# EAGLE board Arduino_kuukulgur-alternatiivne2 (EAGLE 6.3)
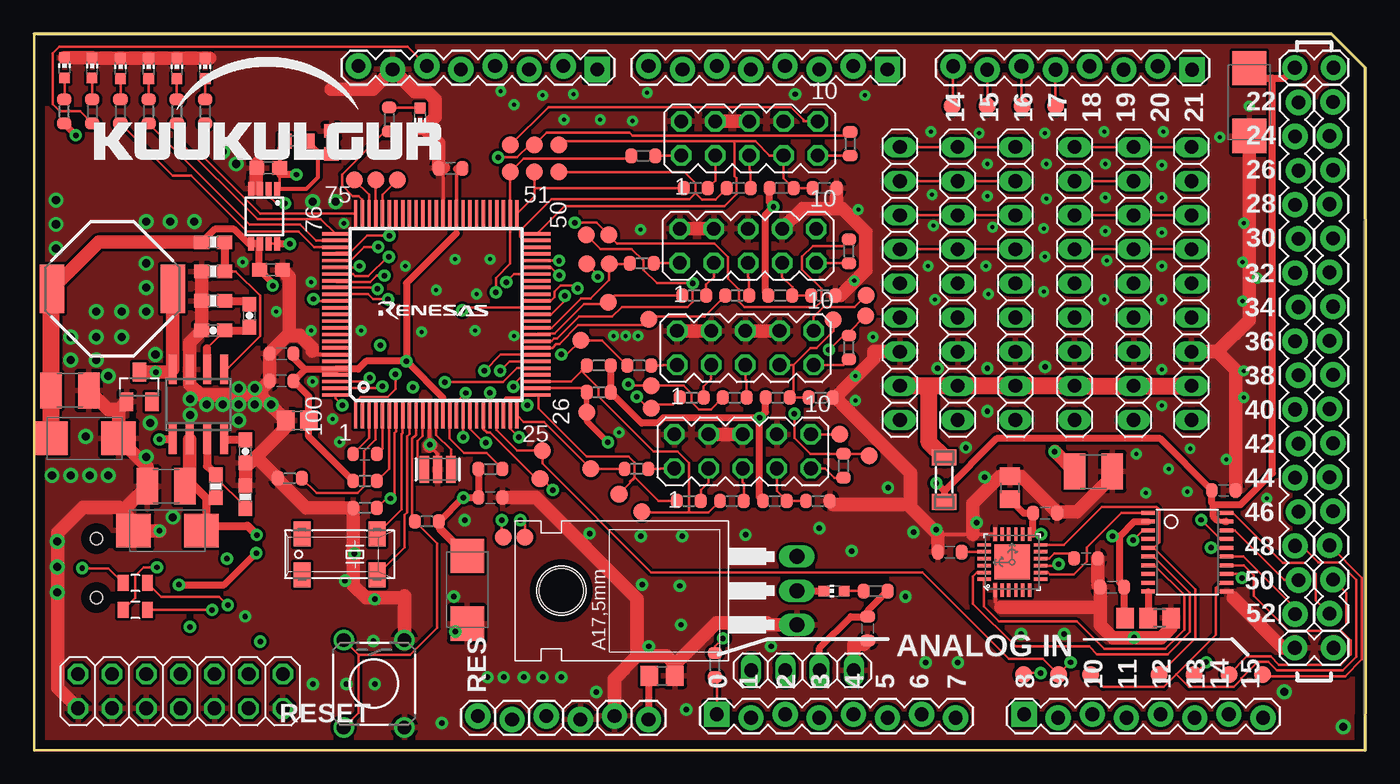
[diagram p8: board, top side]
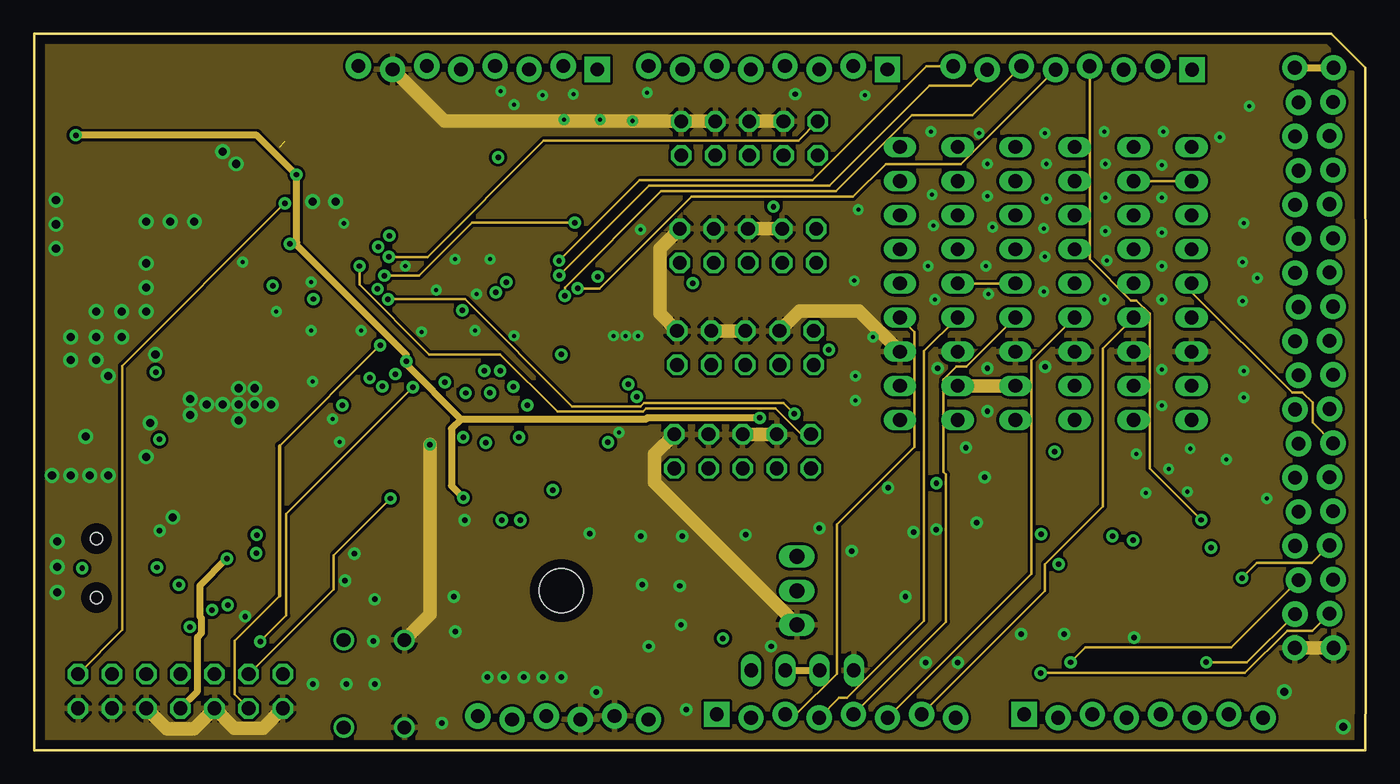
[diagram p9: board, inner layer Route2]
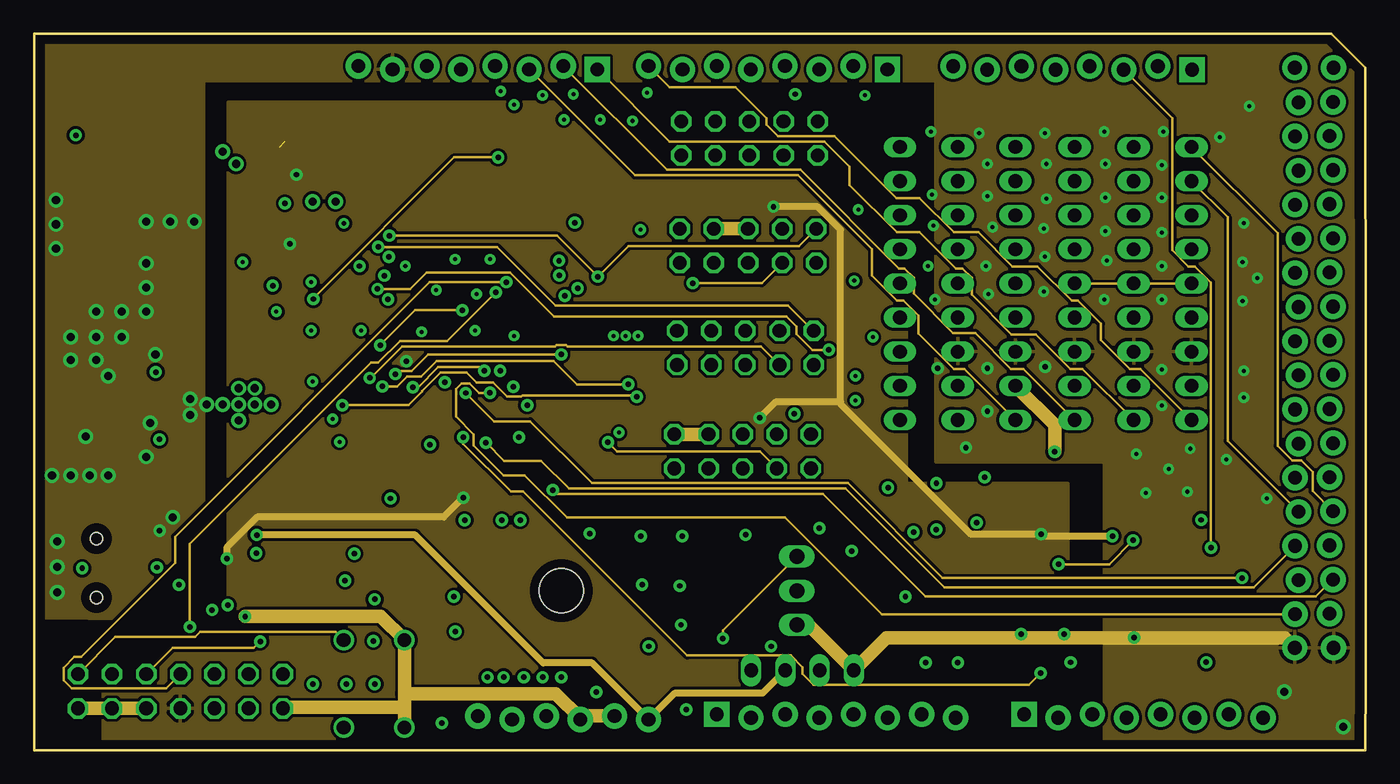
[diagram p10: board, inner layer Route15]
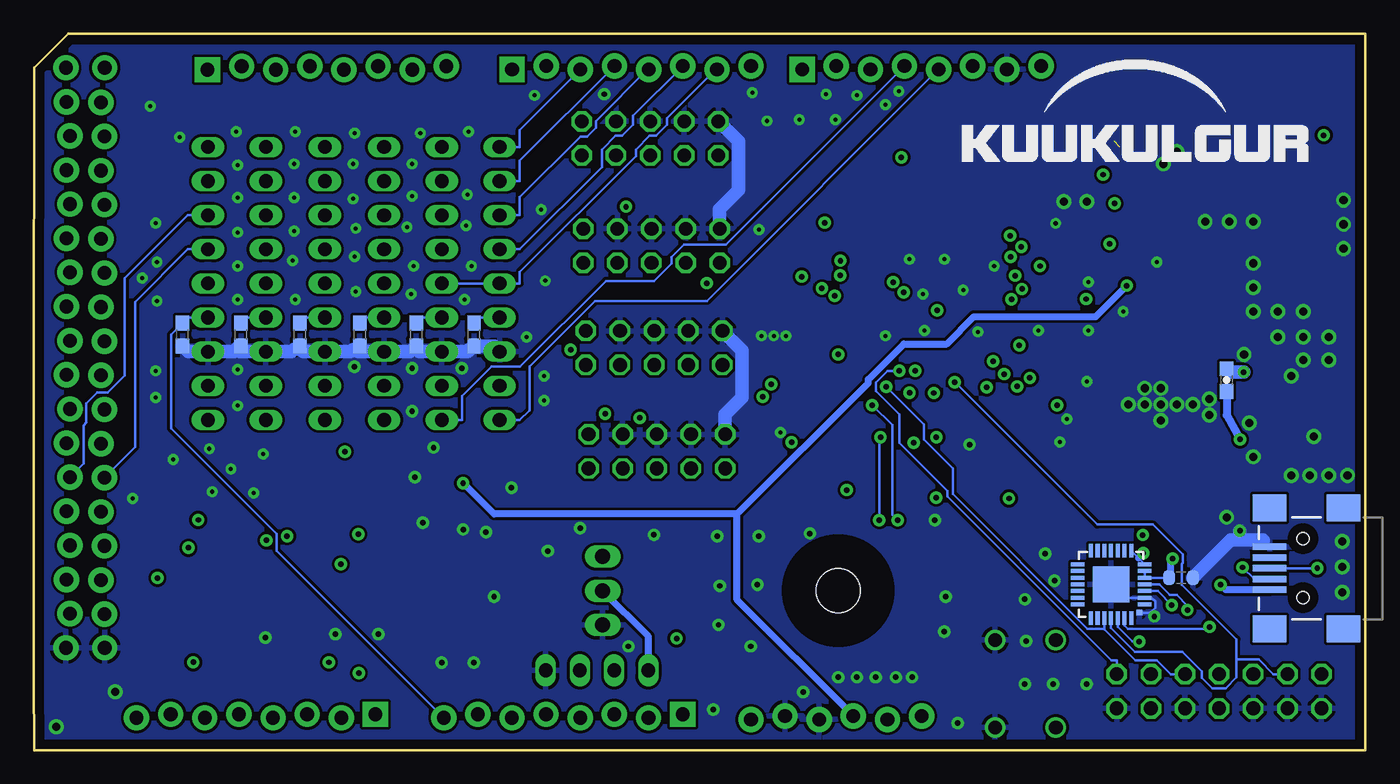
[diagram p11: board, bottom side, seen from below]

Size 99.1 x 53.34 mm. Coordinates in mm from the lower left corner, seen from the top.
Outline: 0,0 99.06,0 99.06,1.27 99.1,4.11 99.1,38.4 99.06,40.64 99.06,50.8 96.52,53.34 0,53.34 0,0
Copper layers (1*2+15*16): Top 0.035mm / dielectric 0.2mm / Route2 0.035mm / dielectric 0.15mm / Route15 0.035mm / dielectric 0.2mm / Bottom 0.035mm
Design rules "default *": minimum track width 8mil, minimum drill 16mil, track to track 6mil, track to pad 7mil, pad to pad 8mil, via to via 10mil, smd to smd 7mil, copper to edge 27mil, drill to drill 12mil, minimum pad ring 10mil, minimum via ring 10mil, stop-mask expansion 2mil, vias tented up to drill 24mil, thermal gap 10mil
Net classes: 0 default: width 0.203 mm, drill 0.203 mm, clearance 0.203 mm; 1 power: width 0.508 mm, drill 0.508 mm, clearance 0.203 mm; 2 morepower: width 1.016 mm, drill 0.508 mm, clearance 0.203 mm; 3 gnd: width 0.305 mm, drill 0.305 mm, clearance 0.203 mm

## Footprints (pad centres in the part's own frame; a part is rotated, then mirrored left to right if it is on the bottom)
C0603-ROUND = smd 0.898 x 1.1: 1 -0.889,0; 2 0.889,0
C0805 = smd 1.3 x 1.5: 1 -0.95,0; 2 0.95,0
0603-CAP = smd 1.1 x 1: 1 -0.85,0; 2 0.85,0
C0805' = smd 1.3 x 1.5: 1 -0.85,0; 2 0.85,0
C1210 = smd 1.6 x 2.7: 1 -1.4,0; 2 1.4,0
C0603 = smd 1.1 x 1: 1 -0.85,0; 2 0.85,0
C/6032-28R = smd 2.55 x 2.5: + 2.525,0; - -2.525,0
SOT23 = smd 1 x 1.4: 1 -0.95,-1.1; 2 0.95,-1.1; 3 0,1.1
MSOP8 = smd 0.45 x 1: 1 -0.975,-2.05; 2 -0.325,-2.05; 3 0.325,-2.05; 4 0.975,-2.05; 5 0.975,2.05; 6 0.325,2.05; 7 -0.325,2.05; 8 -0.975,2.05
MLP28 = smd 1 x 0.3: 1 -2.5,1.5; 2 -2.5,1; 3 -2.5,0.5; 4 -2.5,0; 5 -2.5,-0.5; 6 -2.5,-1; 7 -2.5,-1.5; 15 2.5,-1.5; 16 2.5,-1; 17 2.5,-0.5; 18 2.5,0; 19 2.5,0.5; 20 2.5,1; 21 2.5,1.5 | smd 0.3 x 1: 8 -1.5,-2.5; 9 -1,-2.5; 10 -0.5,-2.5; 11 0,-2.5; 12 0.5,-2.5; 13 1,-2.5; 14 1.5,-2.5; 22 1.5,2.5; 23 1,2.5; 24 0.5,2.5; 25 0,2.5; 26 -0.5,2.5; 27 -1,2.5; 28 -1.5,2.5 | smd 2.7 x 2.7: EXP 0,0 | smd 0.435 x 0.435: M -2.103,2.103
B0R-JMP = smd 1.5 x 1.3: 1 0,1.7; 2 0,0; 3 0,-1.7
1X08_LOCK = drill 1.016 pad 1.88 square: 1 0,0.127 | drill 1.016 pad 1.88: 2 2.54,-0.127; 3 5.08,0.127; 4 7.62,-0.127; 5 10.16,0.127; 6 12.7,-0.127; 7 15.24,0.127; 8 17.78,-0.127
1X02 = drill 1.016 long: 1 -1.27,0; 2 1.27,0
1X16_LOCK = drill 1.016 pad 1.88: 1 0,0.127; 2 2.54,-0.127; 3 5.08,0.127; 4 7.62,-0.127; 5 10.16,0.127; 6 12.7,-0.127; 7 15.24,0.127; 8 17.78,-0.127; 9 20.32,0.127; 10 22.86,-0.127; 11 25.4,0.127; 12 27.94,-0.127; 13 30.48,0.127; 14 33.02,-0.127; 15 35.56,0.127; 16 38.1,-0.127
1X06_LOCK = drill 1.016 pad 1.88: 1 0,0; 2 2.54,-0.254; 3 5.08,0; 4 7.62,-0.254; 5 10.16,0; 6 12.7,-0.254
1X02_LOCK = drill 1.016 pad 1.88: 1 -0.178,0; 2 2.718,0
1X09 = drill 1.016 long: 1 -10.16,0; 2 -7.62,0; 3 -5.08,0; 4 -2.54,0; 5 0,0; 6 2.54,0; 7 5.08,0; 8 7.62,0; 9 10.16,0
2X07 = drill 1.016 octagon: 1 -7.62,-1.27; 2 -7.62,1.27; 3 -5.08,-1.27; 4 -5.08,1.27; 5 -2.54,-1.27; 6 -2.54,1.27; 7 0,-1.27; 8 0,1.27; 9 2.54,-1.27; 10 2.54,1.27; 11 5.08,-1.27; 12 5.08,1.27; 13 7.62,-1.27; 14 7.62,1.27
SRU1038 = smd 1.8 x 3.6: 1 -4.5,0; 2 4.5,0
SM-1206 = smd 1.2 x 1.8: 1 -1.65,0; 2 1.65,0
CHIP-LED0603 = smd 0.8 x 0.8: A 0,-0.75; C 0,0.75
100P6Q-A = smd 0.25 x 2: 1 -6,-7.5; 2 -5.5,-7.5; 3 -5,-7.5; 4 -4.5,-7.5; 5 -4,-7.5; 6 -3.5,-7.5; 7 -3,-7.5; 8 -2.5,-7.5; 9 -2,-7.5; 10 -1.5,-7.5; 11 -1,-7.5; 12 -0.5,-7.5; 13 0,-7.5; 14 0.5,-7.5; 15 1,-7.5; 16 1.5,-7.5; 17 2,-7.5; 18 2.5,-7.5; 19 3,-7.5; 20 3.5,-7.5; 21 4,-7.5; 22 4.5,-7.5; 23 5,-7.5; 24 5.5,-7.5; 25 6,-7.5; 51 6,7.5; 52 5.5,7.5; 53 5,7.5; 54 4.5,7.5; 55 4,7.5; 56 3.5,7.5; 57 3,7.5; 58 2.5,7.5; 59 2,7.5; 60 1.5,7.5; 61 1,7.5; 62 0.5,7.5; 63 0,7.5; 64 -0.5,7.5; 65 -1,7.5; 66 -1.5,7.5; 67 -2,7.5; 68 -2.5,7.5; 69 -3,7.5; 70 -3.5,7.5; 71 -4,7.5; 72 -4.5,7.5; 73 -5,7.5; 74 -5.5,7.5; 75 -6,7.5 | smd 2 x 0.25: 26 7.5,-6; 27 7.5,-5.5; 28 7.5,-5; 29 7.5,-4.5; 30 7.5,-4; 31 7.5,-3.5; 32 7.5,-3; 33 7.5,-2.5; 34 7.5,-2; 35 7.5,-1.5; 36 7.5,-1; 37 7.5,-0.5; 38 7.5,0; 39 7.5,0.5; 40 7.5,1; 41 7.5,1.5; 42 7.5,2; 43 7.5,2.5; 44 7.5,3; 45 7.5,3.5; 46 7.5,4; 47 7.5,4.5; 48 7.5,5; 49 7.5,5.5; 50 7.5,6; 76 -7.5,6; 77 -7.5,5.5; 78 -7.5,5; 79 -7.5,4.5; 80 -7.5,4; 81 -7.5,3.5; 82 -7.5,3; 83 -7.5,2.5; 84 -7.5,2; 85 -7.5,1.5; 86 -7.5,1; 87 -7.5,0.5; 88 -7.5,0; 89 -7.5,-0.5; 90 -7.5,-1; 91 -7.5,-1.5; 92 -7.5,-2; 93 -7.5,-2.5; 94 -7.5,-3; 95 -7.5,-3.5; 96 -7.5,-4; 97 -7.5,-4.5; 98 -7.5,-5; 99 -7.5,-5.5; 100 -7.5,-6
MA05-2 = drill 1.016 octagon: 1 -5.08,-1.27; 2 -5.08,1.27; 3 -2.54,-1.27; 4 -2.54,1.27; 5 0,-1.27; 6 0,1.27; 7 2.54,-1.27; 8 2.54,1.27; 9 5.08,-1.27; 10 5.08,1.27
MM20SS = smd 1.27 x 1.88: 1 -2.794,-1.524; 2 2.794,-1.524; 3 2.794,1.524; 4 -2.794,1.524
R0603-ROUND = smd 0.898 x 1.1: 1 -0.889,0; 2 0.889,0
0603-RES = smd 1.1 x 1: 1 -0.85,0; 2 0.85,0
0805 = smd 0.8 x 1.2: 1 -0.9,0; 2 0.9,0
R0603 = smd 1 x 1.1: 1 -0.85,0; 2 0.85,0
TACTILE-PTH = drill 1.016: 1 -3.251,2.261; 2 3.251,2.261; 3 -3.251,-2.261; 4 3.251,-2.261
TO220 = drill 1.118 long: 1 -2.54,-6.35; 2 0,-6.35; 3 2.54,-6.35 | hole 3.302: 0,11.176
B1,27 = smd 1.27 x 1.27: TP 0,0
QFN-24-TESTING = smd 1.016 x 0.254: 1 -2.066,1.257; 2 -2.066,0.75; 3 -2.066,0.247; 4 -2.066,-0.287; 5 -2.066,-0.792; 6 -2.066,-1.297; 13 2.086,-1.297; 14 2.086,-0.792; 15 2.086,-0.287; 16 2.086,0.247; 17 2.086,0.75; 18 2.086,1.257 | smd 0.254 x 1.016: 7 -1.267,-2.122; 8 -0.762,-2.122; 9 -0.258,-2.122; 10 0.278,-2.122; 11 0.78,-2.122; 12 1.287,-2.122; 19 1.287,2.082; 20 0.78,2.082; 21 0.278,2.082; 22 -0.258,2.082; 23 -0.762,2.082; 24 -1.267,2.082 | smd 2.616 x 2.616: P$1 0.02,-0.01
TSSOP20 = smd 0.305 x 0.991: 1 -2.925,-2.918; 2 -2.275,-2.918; 3 -1.625,-2.918; 4 -0.975,-2.918; 5 -0.325,-2.918; 6 0.325,-2.918; 7 0.975,-2.918; 8 1.625,-2.918; 9 2.275,-2.918; 10 2.925,-2.918; 11 2.925,2.918; 12 2.275,2.918; 13 1.625,2.918; 14 0.975,2.918; 15 0.325,2.918; 16 -0.325,2.918; 17 -0.975,2.918; 18 -1.625,2.918; 19 -2.275,2.918; 20 -2.925,2.918
SO8 = smd 0.6 x 2.2: 1 -1.905,-2.6; 2 -0.635,-2.6; 3 0.635,-2.6; 4 1.905,-2.6; 5 1.905,2.6; 6 0.635,2.6; 7 -0.635,2.6; 8 -1.905,2.6
USB-MINIB = smd 2.5 x 0.5: D+ 2.5,0; D- 2.5,0.8; GND 2.5,-1.6; ID 2.5,-0.8; VBUS 2.5,1.6 | smd 2.5 x 2: GND@1 -3,-4.5; GND@2 -3,4.5; GND@3 2.5,4.5; GND@4 2.5,-4.5 | hole 0.9: 0,2.2; 0,-2.2
RESONATOR = smd 0.7 x 2: 1 -1,0; 2 0,0; 3 1,0

## Placement (x,y rotation side)
C1  100n  [C0603-ROUND]  18.41,29.52 180 top
C2  2.2nF, 50V  [C0603-ROUND]  68.14,14.74 0 top
C3  100n  [C0603-ROUND]  78.26,14.27 180 top
C4  100n  [C0603-ROUND]  30.98,43.31 180 top
C5  220n  [C0603-ROUND]  18.41,27.49 180 top
C6  100n  [C0603-ROUND]  33.96,18.8 0 top
C7  1uF/16V  [C0805]  46.72,5.54 0 top
C8  100n  [C0603-ROUND]  62.02,9.04 270 top
C9  180pF  [0603-CAP]  16.02,32.34 90 top
C10  4,7uF  [C0603-ROUND]  24.62,22.04 180 top
C11  12pF  [0603-CAP]  13.32,31.24 180 top
C12  47uF  [C0805']  72.6,19.53 90 top
C13  GRM32ER71E226KE15L  [C1210]  9.82,19.64 180 top
C14  GRM32ER71E226KE15L  [C1210]  2.66,26.78 0 top
C15  0.1  [0603-CAP]  10.32,27.54 270 bottom
C16  100n  [C0603-ROUND]  75.22,17.64 180 top
C17  100n  [C0603-ROUND]  80.22,12.14 0 top
C18  100n  [C0603-ROUND]  88.52,19.34 180 top
C19  47uF  [C0805']  19.58,24.53 180 top
C20  [C0603]  66.32,30.94 90 bottom
C21  [C0603]  70.62,30.94 90 bottom
C22  [C0603]  74.82,30.94 90 bottom
C23  [C0603]  79.27,30.94 90 bottom
C24  [C0603]  83.67,30.94 90 bottom
C25  [C0603]  88.02,30.94 90 bottom
C26  1uF/6V  [C0603]  17.42,43.34 180 top
C27  15nF  [0603-CAP]  15.72,22.24 90 top
C28  1uF/6V  [C0603]  17.62,35.74 0 top
C29  100uF/16V  [C/6032-28R]  32.22,11.94 90 top
C30  100uF/16V  [C/6032-28R]  9.92,16.34 0 top
C31  100uF/10V  [C/6032-28R]  90.42,48.24 90 top
C32  GRM32ER71E226KE15L  [C1210]  78.82,20.74 0 top
C33  100n  [C0603-ROUND]  13.72,12.84 0 bottom
C100  100uF/10V  [C/6032-28R]  3.75,23.21 180 top
D100  BAT54  [SOT23]  7.82,27.04 0 top
IC2  TPS77301DGK  [MSOP8]  17.12,39.74 180 top
IC4  CP2103_USB_UART  [MLP28]  18.92,12.34 180 bottom
JMP1  0R-JUMPB  [B0R-JMP]  82.89,9.83 90 top
JP1  [1X08_LOCK]  86.16,50.78 180 top
JP2  [1X02]  54.62,5.94 180 top
JP3  [1X08_LOCK]  41.91,50.8 180 top
JP4  [1X08_LOCK]  63.49,50.8 180 top
JP5  [1X02]  59.72,5.94 0 top
JP6  [1X08_LOCK]  73.66,2.54 0 top
JP7  [1X08_LOCK]  50.8,2.54 0 top
JP8  M16LOCK  [1X16_LOCK]  96.52,10.16 90 top
JP9  M16LOCK  [1X16_LOCK]  93.96,48.22 270 top
JP10  [1X06_LOCK]  33.02,2.54 0 top
JP11  [1X02_LOCK]  93.98,7.62 0 top
JP12  [1X02_LOCK]  93.98,50.8 0 top
JP13  [1X09]  86.12,34.74 270 top
JP14  [1X09]  81.82,34.74 270 top
JP15  [1X09]  77.42,34.74 270 top
JP16  [1X09]  73.02,34.74 270 top
JP17  [1X09]  68.72,34.74 270 top
JP18  [1X09]  64.42,34.74 270 top
JP19  [2X07]  10.88,4.39 180 top
L1  [SRU1038]  5.82,34.34 180 top
L4  LB3218T220K  [SM-1206]  67.72,20.14 90 top
LED1  Blue  [CHIP-LED0603]  2.25,50.79 0 top
LED2  Blue  [CHIP-LED0603]  4.31,50.78 0 top
LED3  Blue  [CHIP-LED0603]  6.42,50.74 0 top
LED4  Blue  [CHIP-LED0603]  8.52,50.74 0 top
LED5  Blue  [CHIP-LED0603]  10.62,50.74 0 top
LED6  Blue  [CHIP-LED0603]  12.72,50.74 0 top
LED7  Yellow  [CHIP-LED0603]  59.52,11.84 90 top
LED8  Red  [CHIP-LED0603]  28.72,47.04 180 top
MCU  R32C111  [100P6Q-A]  29.92,32.44 0 top
MOTOR0  [MA05-2]  53.12,37.54 0 top
MOTOR1  [MA05-2]  52.92,29.94 0 top
MOTOR2  [MA05-2]  52.72,22.24 0 top
MOTOR3  [MA05-2]  53.22,45.54 0 top
Q1  [MM20SS]  22.72,14.58 180 top
R1  82R  [R0603-ROUND]  52.12,26.24 0 top
R2  82R  [R0603-ROUND]  52.32,33.84 0 top
R3  1k2  [R0603-ROUND]  50.66,6.34 270 top
R4  220R  [R0603-ROUND]  58.52,26.24 0 top
R5  220R  [R0603-ROUND]  55.32,26.24 0 top
R6  82R  [R0603-ROUND]  48.92,26.24 0 top
R7  180R  [R0603-ROUND]  45.02,28.64 0 top
R8  220R  [R0603-ROUND]  60.63,29.97 90 top
R9  220R  [R0603-ROUND]  58.72,33.84 0 top
R10  220R  [R0603-ROUND]  55.52,33.84 0 top
R11  82R  [R0603-ROUND]  49.12,33.84 0 top
R12  180R  [R0603-ROUND]  45.22,36.24 0 top
R13  220R  [R0603-ROUND]  60.62,37.14 90 top
R14  82R  [R0603-ROUND]  52.42,41.84 0 top
R15  220R  [R0603-ROUND]  58.82,41.84 0 top
R16  220R  [R0603-ROUND]  55.62,41.84 0 top
R17  82R  [R0603-ROUND]  49.22,41.84 0 top
R18  180R  [R0603-ROUND]  45.32,44.24 0 top
R19  220R  [R0603-ROUND]  60.72,45.14 90 top
R20  82R  [R0603-ROUND]  51.92,18.54 0 top
R21  220R  [R0603-ROUND]  58.32,18.54 0 top
R22  220R  [R0603-ROUND]  55.12,18.54 0 top
R23  82R  [R0603-ROUND]  48.72,18.54 0 top
R24  180R  [R0603-ROUND]  44.82,20.94 0 top
R25  220R  [R0603-ROUND]  60.22,21.16 90 top
R26  4k7  [R0603-ROUND]  24.62,20.04 180 top
R27  1k  [R0603-ROUND]  2.22,47.54 90 top
R28  1k  [R0603-ROUND]  4.32,47.54 90 top
R29  63k4  [0603-RES]  13.32,33.44 0 top
R30  4k7  [R0603-ROUND]  29.22,17.04 0 top
R31  4k7  [R0603-ROUND]  33.95,20.93 180 top
R32  4k7  [R0603-ROUND]  42.02,28.64 180 top
R33  4k7  [R0603-ROUND]  42.02,26.64 180 top
R34  4k7  [R0603-ROUND]  24.62,18.04 180 top
R35  100k  [0603-RES]  13.52,19.64 270 top
R36  1k87  [0603-RES]  13.32,35.64 180 top
R37  10k  [0603-RES]  13.32,37.81 0 top
R38  1k  [R0603-ROUND]  6.42,47.54 90 top
R39  1k  [R0603-ROUND]  8.52,47.54 90 top
R40  1k  [R0603-ROUND]  10.62,47.54 90 top
R41  1k  [R0603-ROUND]  12.72,47.54 90 top
R42  3k3  [R0603-ROUND]  62.62,11.84 180 top
R43  1k  [R0603-ROUND]  26.42,46.94 90 top
R44  47k  [R0603-ROUND]  19.02,20.24 180 top
R45  21k5  [0603-RES]  15.72,18.84 270 top
R46  22r  [0805]  7.52,12.44 180 top
R47  22r  [0805]  7.52,10.44 180 top
R48  118k  [R0603]  19.52,45.34 180 top
R49  42.2k  [R0603]  22.12,45.24 270 top
S1  [TACTILE-PTH]  25.29,4.94 270 top
T1  BD651  [TO220]  50.4,11.87 90 top
TP1  TPB1,27  [B1,27]  73.62,5.64 180 top
TP2  TPB1,27  [B1,27]  76.22,5.64 180 top
TP4  TPB1,27  [B1,27]  83.72,5.64 90 top
TP5  TPB1,27  [B1,27]  86.32,5.64 90 top
TP6  TPB1,27  [B1,27]  88.92,5.64 90 top
TP7  TPB1,27  [B1,27]  91.42,5.64 90 top
TP8  TPB1,27  [B1,27]  78.62,5.64 0 top
TP9  TPB1,27  [B1,27]  42.78,36.2 90 top
TP10  TPB1,27  [B1,27]  42.71,33.35 90 top
TP11  TPB1,27  [B1,27]  45.75,32.07 90 top
TP12  TPB1,27  [B1,27]  41.1,38.35 90 top
TP13  TPB1,27  [B1,27]  42.76,38.34 90 top
TP14  TPB1,27  [B1,27]  41.1,36.2 90 top
TP15  TPB1,27  [B1,27]  40.68,30.51 90 top
TP16  TPB1,27  [B1,27]  45.92,25.44 90 top
TP17  TPB1,27  [B1,27]  45.92,27.14 90 top
TP18  TPB1,27  [B1,27]  59.46,32.05 90 top
TP19  TPB1,27  [B1,27]  61.87,32.35 90 top
TP20  TPB1,27  [B1,27]  61.9,33.84 90 top
TP21  TPB1,27  [B1,27]  41.42,20.94 90 top
TP22  TPB1,27  [B1,27]  43.52,19.04 90 top
TP23  TPB1,27  [B1,27]  45.22,17.74 90 top
TP24  TPB1,27  [B1,27]  41.12,25.14 90 top
TP25  TPB1,27  [B1,27]  62.14,21.9 90 top
TP26  TPB1,27  [B1,27]  59.94,23.52 90 top
TP27  TPB1,27  [B1,27]  35.42,43.04 90 top
TP28  TPB1,27  [B1,27]  37.22,43.04 90 top
TP29  TPB1,27  [B1,27]  39.02,43.04 90 top
TP30  TPB1,27  [B1,27]  39.02,45.04 90 top
TP31  TPB1,27  [B1,27]  37.22,45.04 90 top
TP32  TPB1,27  [B1,27]  35.42,45.04 90 top
TP33  TPB1,27  [B1,27]  70.92,47.94 0 top
TP34  TPB1,27  [B1,27]  68.32,47.94 0 top
TP35  TPB1,27  [B1,27]  73.52,47.94 0 top
TP36  TPB1,27  [B1,27]  76.02,47.94 0 top
TP37  TPB1,27  [B1,27]  37.81,22.3 0 top
TP38  TPB1,27  [B1,27]  37.64,20.22 0 top
TP39  TPB1,27  [B1,27]  23.82,42.44 0 top
TP40  TPB1,27  [B1,27]  25.42,42.44 0 top
TP41  TPB1,27  [B1,27]  27.02,42.44 0 top
TP43  TPB1,27  [B1,27]  36.52,15.84 0 top
TP44  TPB1,27  [B1,27]  34.92,15.84 0 top
U1  MPU-6000QFN-24  [QFN-24-TESTING]  72.77,13.99 90 top
U2  txb0108  [TSSOP20]  85.82,14.74 270 top
U$3  TPS54332  [SO8]  12.22,25.74 0 top
X2  USBSMD  [USB-MINIB]  4.62,13.54 180 bottom
Y1  CSTCE8M00G15C99-R0  [RESONATOR]  30.02,20.91 0 top

## Tracks (layer width: path | path; a pad name or v marks a point on that pad's centre or on a via)
+4V5  (via drill 0.41 pad 0.91)  (1 unrouted)
  Top 0.203: C26.1 18.27,42.84 18.27,41.96 | IC2.8 IC2.7
  Top 0.25: 22.42,28.2 22.42,28.34 22.42,28.36 MCU.96 | 30.42,26.23 MCU.14 | 31.42,38.48 MCU.60 31.42,43.27 | 22.42,28.19 MCU.97
  Top 0.254: U1.13 74.33,16.08 v74.93,16.08
  Top 0.305: v19.5,42.84 19.52,42.84 19.62,42.94 | C26.1 18.27,44.04 18.27,44.89
  Top 0.508: 31.42,38.48 27.7,34.76 v27.7,28.95 | R26.2 20.43,23.34 C19.1 20.43,26.35 C5.1 20.15,28.34 | 20.15,28.34 19.3,29.19 C1.1 | 22.42,28.34 20.15,28.34 | JMP1.1 81.11,9.91 C17.2 80.78,12.47 80.78,15.93 | R16.1 54.73,40.74 v55.01,40.46 54.39,39.83 54.39,34.08 R10.1 | v27.7,28.95 24.71,28.95 24.12,28.36 22.42,28.36 | v27.7,28.95 30.42,26.23 | IC2.8 v19.03,37.69 | R30.2 30.17,17.04 v31.93,18.8 C6.1 | R27.1 v3.1,45.77 | v19.5,42.84 18.27,42.84 | R32.1 R33.1 45.2,24.35 46.42,24.35 46.8,24.73 v53.99,24.73 | 22.42,28.19 22.42,28.2 | v53.99,24.73 54.43,25.17 R5.1 | R22.1 53.99,18.78 v53.99,24.73 | 74.33,16.08 C16.2 73.64,17.64 C12.1 | 80.78,15.93 81.87,17.02 U2.2 | 80.78,15.93 v80.24,15.93 | C4.1 31.46,43.31 31.42,43.27 | R31.2 C6.1 | C6.1
  Top 0.61: 30.17,17.04 30.17,16.51 C29.+
  Route2 0.508: 31.76,24.63 27.7,28.7 v27.7,28.95 27.7,29.42 19.42,37.69 | 19.42,37.69 19.53,37.8 19.53,42.81 v19.5,42.84 16.57,45.77 v3.1,45.77 | v19.03,37.69 19.42,37.69 | 31.76,24.63 31.06,23.93 31.06,19.68 v31.93,18.8 | v53.99,24.73 45.62,24.73 45.53,24.63 31.76,24.63 | JP19.8 12.15,4.39 12.15,8.41 12.46,8.72 12.46,9.83 12.33,9.95 12.33,12.25 v14.34,14.26
  Route15 0.508: 60,25.95 60,38.74 58.29,40.46 v55.01,40.46 | 60,25.95 60,25.78 69.71,16.08 v74.93,16.08 75.08,15.93 v80.24,15.93 | v53.99,24.73 55.21,25.95 60,25.95 | v31.93,18.8 30.48,17.34 16.6,17.34 14.34,15.08 v14.34,14.26
  Bottom 0.203: IC4.6 IC4.5 C33.1
  Bottom 0.508: v14.34,14.26 14.5,14.1 | 14.5,14.1 | 14.5,14.1 14.5,12.95 C33.1
  pour Route15: 76.92,0.24 76.92,19.84 64.92,19.84 64.92,48.24 14.42,48.24 14.42,9.44 5.12,9.44 5.12,0.14 77.02,0.14
+5V  (via drill 0.41 pad 0.91)
  Top 0.203: 16.42,37.69 IC2.5 | IC2.6 16.7,37.69 16.47,37.69
  Top 0.305: 88.02,17.11 88.53,17.11 88.63,17.02
  Top 0.508: C14.1 1.23,26.75 | 1.26,34.28 L1.2 | 87.76,18.28 89.79,18.28 92.14,20.62 92.14,50.03 | 88.02,17.11 87.76,17.37 87.76,18.28 | 16.47,37.69 16.42,37.69 | U2.19 88.63,17.02 | C31.+ 91.15,50.03 92.14,50.03 | 92.14,50.03 93.03,50.03 JP12.1 | IC2.5 15.96,37.69 14.88,38.77 13.43,38.77 R37.1 | 16.7,37.69 16.7,35.81 C28.1 17.75,34.76 v17.75,34.58 | 87.76,18.28 87.63,18.41 C18.2 83.79,23.19 71.61,23.19 67.72,19.3 | v67.14,19.88 67.72,19.3 | 67.72,19.3 L4.1
  Top 1.016: R37.1 4.79,37.81 L1.2
  Top 1.27: 1.23,26.75 C100.+ | C14.1 1.26,34.28
  Route2 0.508: JP12.1 JP12.2
  Bottom 0.508: 46.74,17.57 36.98,27.32 36.98,27.61 34.34,30.25 31.15,30.25 29.14,32.26 20.07,32.26 v17.75,34.58 | JP10.3 46.74,11.18 46.74,17.57 | 46.74,17.57 64.83,17.57 v67.14,19.88
+5V_A  (via drill 0.41 pad 0.91)
  Top 1.016: JP18.8 66.59,27.12 JP17.8 | v75.94,22.22 C32.1
  Top 1.27: L4.2 66.59,22.92 66.59,27.12 | 66.59,27.12 JP15.8 JP14.8 | 66.59,27.12 JP18.8 | JP14.8 JP13.8 JP14.8
  Route2 1.016: JP17.8 JP16.8
  Route15 1.016: JP16.8 75.94,24.2 v75.94,22.22
_CLK0
  Top 0.203: MCU.35 37.51,31.03 38.74,31.03 40.91,33.2 42.56,33.2 TP10.TP 43.2,33.84 R11.1
_CLK2
  Top 0.203: MCU.26 37.52,26.34 37.52,25.45 41.11,21.86 44.24,21.86 44.67,21.43 44.67,20.33 | 44.67,20.33 46.46,18.54 R23.1 | 44.67,20.33 44.33,20 44.58,20.2 TP22.TP
_CLK3
  Top 0.203: 37.22,41.84 TP28.TP | MCU.51 37.22,41.24 37.22,41.84 | R17.1 37.22,41.84
_CLK4  (via drill 0.41 pad 0.91)
  Top 0.203: v22.92,25.68 22.42,26.18 MCU.100 | 45.92,25.73 TP16.TP | R6.1 47.52,25.73 45.92,25.73 | 45.92,25.73 45.41,25.73 v44.83,26.31
  Route15 0.203: v22.92,25.68 27.85,25.68 28.88,26.71 28.88,26.75 30.23,28.11 32.19,28.11 32.92,27.37 34.15,27.37 35.19,26.33 36.24,26.33 36.32,26.41 44.73,26.41 v44.83,26.31
_CRESET0  (via drill 0.41 pad 0.91)
  Top 0.203: MCU.83 22.51,34.85 24.99,34.85 25.46,35.32 v26.06,35.32 | R13.2 60.13,37.54 57.94,37.54 57.14,36.74 57.14,35.78 58.57,34.35 58.57,33.4 58.15,32.98 52.87,32.98 52.46,33.38 52.46,34.28 51.63,35.11 51.63,36.7 50.62,37.72 43.38,37.72 TP13.TP 41.84,39.26 v40.23,39.26
  Route2 0.203: v26.06,35.32 28.64,35.32 32.58,39.26 v40.23,39.26
_CRESET1  (via drill 0.41 pad 0.91)
  Top 0.203: MCU.84 25.43,34.44 v25.55,34.32 | v59.14,29.8 60.21,30.86 R8.2 60.62,31.1 TP19.TP
  Route15 0.203: v25.55,34.32 27.98,34.32 29.2,35.55 35.42,35.55 38.69,32.28 56,32.28 56.74,31.53 56.74,30.97 57.92,29.8 v59.14,29.8
_CRESET2  (via drill 0.41 pad 0.91)
  Top 0.203: TP25.TP 62.14,22.04 R25.2 57.75,22.05 56.57,23.23 v56.57,25.03 | MCU.85 24.86,33.94 25.23,33.56 v26.33,33.56
  Route2 0.203: v26.33,33.56 32.06,33.56 40.03,25.6 45.13,25.6 45.38,25.85 55.75,25.85 v56.57,25.03
_CRESET3  (via drill 0.41 pad 0.91)
  Top 0.203: v34.53,44.12 35.93,44.12 36.84,45.04 TP31.TP 38.14,45.96 44.3,45.96 44.52,45.74 60.43,45.74 R19.2 | MCU.86 20.92,33.44 v20.78,33.58
  Route15 0.203: v20.78,33.58 20.78,33.65 31.25,44.12 v34.53,44.12
_CS0
  Top 0.203: MCU.36 38.5,31.44 40.67,33.61 41.4,33.61 42.78,34.99 TP9.TP 44.29,36.2 R12.1
_CS2
  Top 0.203: R24.1 TP21.TP 37.93,24.43 36.43,24.43 MCU.25
_CS3  (via drill 0.41 pad 0.91)
  Top 0.203: v34.36,34.08 34.36,35.15 35.42,36.21 MCU.52 TP27.TP 36.42,44.04 44.23,44.04 R18.1
  Route15 0.203: v11.58,9.17 11.58,15.36 25.07,28.85 25.59,28.85 27.21,30.46 30.74,30.46 v34.36,34.08
  Bottom 0.203: v11.58,9.17 11.73,9.03 17.67,9.03 17.92,9.27 IC4.27
_CS4  (via drill 0.41 pad 0.91)
  Top 0.203: v39.22,29.45 39.62,29.45 TP15.TP 42.26,30.51 R7.1 | v26.88,28 26.88,26.89 26.29,26.3 24.29,26.3 23.92,25.93 MCU.1
  Route15 0.203: v26.88,28 27.11,28.23 28.09,28.23 29.32,29.45 v39.22,29.45
_MISO0  (via drill 0.41 pad 0.91)
  Top 0.203: MCU.34 38.5,30.44 38.68,30.62 38.91,30.62 40.56,32.27 43.02,32.27 43.73,32.99 48.63,32.99 49,33.36 v49,34.77 46.34,34.77 45.35,35.75 45.35,36.43 44.46,37.31 42.13,37.31 TP12.TP | MOTOR0.7 55.66,35.23 56.41,34.48 R10.2 R9.1
  Route15 0.203: MOTOR0.7 54.16,34.77 v49,34.77
_MISO2  (via drill 0.41 pad 0.91)
  Top 0.203: R33.2 40.83,26.94 MCU.27 | MOTOR2.7 55.26,19.29 R22.2 R21.1
  Top 0.406: R33.2 TP24.TP 41.12,24.49 v42.7,22.91
  Route15 0.203: MOTOR2.7 53.99,22.24 43.37,22.24 v42.7,22.91
_MISO3
  Top 0.203: 52.13,45.33 39.31,45.33 TP30.TP | 52.13,45.33 53.66,45.33 54.72,44.27 MOTOR3.7 55.76,42.59 R16.2 R15.1 | 52.13,45.33 52.13,42.72 52.27,42.57 52.27,41.4 51.38,40.5 39.48,40.5 MCU.50
_MISO4  (via drill 0.41 pad 0.91)
  Top 0.203: MCU.98 24.7,27.44 v24.97,27.71 | 56.5,26.24 R4.1 | R5.2 56.5,26.24 | 56.5,26.24 56.5,28.67 | MOTOR1.7 56.5,28.67 | TP18.TP 59.46,31.2 58.2,29.94 57.77,29.94 56.5,28.67
  Route15 0.203: v24.97,27.71 25.03,27.71 27.38,30.06 38.76,30.06 38.87,30.17 39.57,30.17 39.68,30.06 54.07,30.06 MOTOR1.7
_MOSI0
  Top 0.203: MCU.33 38.57,29.94 38.85,30.22 39.08,30.22 40.49,31.63 45.3,31.63 TP11.TP 45.95,32.28 49.87,32.28 R2.1
_MOSI2
  Top 0.203: 48.72,17.69 50.18,17.69 R20.1 | TP23.TP 44.97,17.69 48.72,17.69 | 40.72,28.23 42,26.95 42,26.31 46.08,22.23 47.89,22.23 48.72,21.4 48.72,17.69 | 40.72,28.23 R32.2 | MCU.28 39.93,27.44 40.72,28.23
_MOSI3
  Top 0.203: 49.22,41.47 49.22,42.2 48.38,43.04 TP29.TP | R14.1 50.69,40.99 49.7,40.99 49.22,41.47 | 49.22,41.47 48.75,41.01 38.49,41.01 36.14,38.66 36.14,38.22 36.42,37.94 MCU.49
_MOSI4  (via drill 0.41 pad 0.91)
  Top 0.203: v44.22,27.23 44.31,27.14 TP17.TP 48.33,27.14 48.92,26.55 48.92,25.93 49.48,25.37 50.36,25.37 R1.1 | v25.91,27.08 25.78,26.94 MCU.99
  Route15 0.203: v25.91,27.08 26.99,27.08 27.73,27.82 28.8,27.82 29.95,28.97 38.65,28.97 40.38,27.23 v44.22,27.23
A0
  Top 0.203: R3.2 50.8,5.31 JP7.1
A2
  Route2 0.203: JP18.6 65.51,31.11 65.51,22.58 59.72,16.79 59.72,5.7 56.69,2.67 JP7.3
  Bottom 0.203: JP18.6 65.92,32.2 65.92,32.19 C20.2
A3
  Route2 0.203: JP17.6 66.22,29.7 66.22,9.64 60.48,3.89 59.9,3.89 JP7.4
  Bottom 0.203: JP17.6 70.22,32.2 70.22,32.19 C21.2
A4
  Route2 0.203: JP7.5 67.85,9.56 67.85,20.51 67.65,20.71 67.65,27.59 68.63,28.57 69.39,28.57 JP16.6
  Bottom 0.203: JP16.6 74.52,32.2 74.52,32.09 C22.2
A5
  Route2 0.203: JP15.6 74.22,29 74.22,13.13 JP7.6
  Bottom 0.203: JP15.6 78.92,32.2 78.92,32.14 C23.2
A6
  Route2 0.203: JP14.6 79.53,29.91 79.53,18.14 75.22,13.83 75.22,11.84 JP7.7
  Bottom 0.203: JP14.6 83.32,32.2 83.32,32.14 C24.2
A7
  Bottom 0.203: JP7.8 81,14.83 81,16.08 88.87,23.96 88.87,30.94 C25.2 87.62,32.19 87.62,32.2 JP13.6
CDONE0  (via drill 0.41 pad 0.91)
  Top 0.203: v26.43,38.3 24.77,38.3 23.5,37.03 22.51,37.03 | 22.51,37.03 | 22.51,37.03 MCU.79 | TP14.TP 41.94,35.36 v41.94,35.25
  Route15 0.203: v26.43,38.3 38.89,38.3 v41.94,35.25 44.23,37.53 56.92,37.53 MOTOR0.10
CDONE1  (via drill 0.41 pad 0.91)
  Top 0.203: TP20.TP 61.03,32.97 58.72,32.97 58,32.25 MOTOR1.10 | MCU.80 23.54,36.44 24.56,37.46 v25.6,37.46
  Route15 0.203: MOTOR1.10 56.11,33.1 38.8,33.1 34.44,37.46 v25.6,37.46
CDONE2  (via drill 0.41 pad 0.91)
  Top 0.203: MCU.81 24.11,35.94 v24.21,36.03 | TP26.TP 60.04,23.51 MOTOR2.10
  Route2 0.203: MOTOR2.10 57.09,23.51 55.16,25.44 45.54,25.44 45.3,25.19 38.93,25.19 34.66,29.46 29.4,29.46 24.21,34.66 v24.21,36.03
CDONE3  (via drill 0.41 pad 0.91)
  Top 0.203: v26.39,36.72 26.29,36.72 24.84,35.27 23.89,35.27 23.72,35.44 MCU.82 | MOTOR3.10 57.26,46.81 57.26,46.92 56.3,47.88 38.26,47.88 TP32.TP
  Route2 0.203: MOTOR3.10 56.87,45.38 37.92,45.38 29.26,36.72 v26.39,36.72
CLK0
  Top 0.203: MOTOR0.3 50.58,35.23 50.01,34.66 R11.2
CLK1
  Top 0.203: MOTOR1.3 50.38,27.63 49.81,27.06 R6.2
CLK2
  Top 0.203: MOTOR2.3 50.18,19.93 49.61,19.36 R23.2
CLK3
  Top 0.203: MOTOR3.3 50.68,42.41 R17.2
CNVSS  (via drill 0.41 pad 0.91)
  Top 0.203: MCU.7 26.92,23.71 26.82,23.61 26.82,19.04 v26.52,18.74 26.21,18.74 R34.1
  Route2 0.203: v26.52,18.74 22.28,14.5 22.28,11.98 JP19.3
CPOUT
  Top 0.203: U1.20 69.06,14.77 C2.2
CRESET0
  Top 0.203: MOTOR0.9 59.24,36.27 59.26,36.25 R13.1
CRESET1
  Top 0.203: R8.1 60.21,28.67 59.04,28.67 MOTOR1.9
CRESET2
  Top 0.203: MOTOR2.9 58.84,20.97 59.54,20.27 R25.1
CRESET3
  Top 0.203: MOTOR3.9 59.34,44.27 59.36,44.25 R19.1
CS0
  Top 0.203: MOTOR0.1 47,36.27 46.97,36.24 R12.2
CS1
  Top 0.203: MOTOR1.1 46.8,28.67 46.77,28.64 R7.2
CS2
  Top 0.203: MOTOR2.1 46.6,20.97 46.57,20.94 R24.2
CS3
  Top 0.203: MOTOR3.1 47.1,44.27 47.07,44.24 R18.2
CS_GYRO_3V
  Top 0.203: U1.8 75.44,13.23 75.6,13.07 77.38,13.07 78.34,14.04 78.34,15.11 80.9,17.67 U2.1
CS_GYRO_5V_D53  (via drill 0.41 pad 0.91)
  Top 0.203: MCU.17 v31.92,23.3 | U2.20 89.2,17.67 92.93,13.93 94.57,13.93 95.39,13.12 95.39,11.17 JP8.1 | v74.9,5.74 73.72,5.74 TP1.TP
  Route2 0.203: JP8.1 95.12,8.88 93.24,8.88 90.1,5.74 v74.9,5.74
  Route15 0.203: v74.9,5.74 74.01,4.86 57.98,4.86 57.17,5.67 57.17,6.17 56.3,7.04 48.59,7.04 36.38,19.25 35.47,19.25 31.92,22.8 v31.92,23.3
CS_MOTOR_5V_D49  (via drill 0.41 pad 0.91)
  Top 0.203: JP8.3 96.41,15.24 98.81,12.84 98.81,6.77 97.55,5.51 91.55,5.51 TP7.TP | MCU.16 31.42,25.94 32.07,26.59 v32.11,26.59 | U2.13 89.58,13.12 v89.88,12.82
  Route2 0.203: v89.88,12.82 90.99,13.93 95.08,13.93 JP8.3
  Route15 0.203: v32.11,26.59 34.21,24.48 36.9,24.48 41.5,19.88 60.54,19.88 67.6,12.82 v89.88,12.82
D2
  Top 0.203: JP18.1 JP17.1 JP16.1
  Bottom 0.203: JP18.1 62.92,44.9 62.92,46.16 JP4.3
D3
  Top 0.203: JP16.2 JP17.2 JP18.2
  Bottom 0.203: JP18.2 62.92,42.36 62.92,43.88 JP4.4
D4
  Top 0.203: JP16.3 JP17.3 JP18.3
  Bottom 0.203: JP18.3 62.92,39.82 62.92,41.16 58.39,45.68 57.91,45.68 57.26,46.33 57.26,46.83 53.41,50.67 JP4.5
D5
  Top 0.203: JP16.4 JP17.4 JP18.4
  Bottom 0.203: JP18.4 62.92,37.28 56.81,43.39 56.81,44.71 55.8,45.73 55.31,45.73 54.49,46.55 54.49,47.23 JP4.6
D6
  Route2 0.203: JP17.5 JP16.5
  Bottom 0.203: JP4.7 48.33,50.67 51.95,47.05 51.95,46.54 52.77,45.72 53.26,45.72 54.27,44.71 54.27,44.22 62.92,35.57 62.92,34.74 JP18.5 JP17.5
D7
  Route15 0.203: JP13.9 82.31,28.39 81.53,28.39 79.39,30.53 79.39,31.74 77.66,33.47 77.21,33.47 74.67,36.01 72.79,36.01 70.25,38.55 68.43,38.55 65.89,41.09 64.17,41.09 59.54,45.72 55.34,45.72 54.49,46.56 54.49,47.06 52.2,49.35 47.29,49.35 JP4.8
D8
  Route15 0.203: JP14.9 78.01,28.39 77.1,28.39 74.55,30.94 72.73,30.94 69.76,33.91 69.76,35.17 69.07,35.87 68.58,35.87 65.89,38.55 64.19,38.55 60.69,42.05 60.69,43.43 58.8,45.31 47.27,45.31 JP3.1
D9
  Route15 0.203: JP15.9 73.61,28.39 72.69,28.39 70.02,31.06 68.38,31.06 65.46,33.98 65.46,35.17 64.77,35.87 64.34,35.87 57,43.21 47.09,43.21 JP3.2
D10
  Route15 0.203: JP3.3 44.7,42.8 56.84,42.8 62.34,37.29 62.34,35.33 64.2,33.47 64.69,33.47 65.81,32.35 65.81,31.01 68.43,28.39 69.21,28.39 JP16.9
D11
  Bottom 0.203: JP17.9 67.22,24.58 67.22,26.35 65.02,28.55 62.9,28.55 56.52,34.93 52.94,34.93 51.63,36.23 51.63,36.72 50.71,37.64 47.58,37.64 JP3.4
D12
  Bottom 0.203: JP18.9 62.92,24.58 62.21,25.3 62.21,28.56 57.33,33.44 48.98,33.44 JP3.5
D13
  Top 0.203: R28.1 3.41,47.56 1.91,47.56 1.37,48.09 1.37,51.88 1.85,52.35 27.78,52.35 JP3.6
D18  (via drill 0.41 pad 0.91)
  Top 0.203: U2.17 88.27,15.71 v86.85,17.14
  Route2 0.203: v86.85,17.14 83.02,20.97 83.02,32.48 82.03,33.47 81.61,33.47 78.54,36.54 JP1.4
D19  (via drill 0.41 pad 0.91)
  Top 0.203: U2.16 v87.57,15.06
  Route15 0.203: JP1.3 84.7,47.03 84.7,37.21 85.89,36.01 86.38,36.01 87.57,34.82 v87.57,15.06
D43
  Route2 0.203: JP13.5 86.12,34.11 93.6,26.63 94.36,26.63 95.13,25.86 95.13,24.37 JP8.6
  Route15 0.203: JP15.5 JP14.5 JP13.5
D44
  Top 0.203: JP13.4 JP14.4 JP15.4
  Bottom 0.203: JP13.4 87.62,37.28 91.53,33.37 91.53,22.58 JP9.12
D45
  Top 0.203: JP13.3 JP14.3 JP15.3
  Bottom 0.203: JP13.3 87.62,39.82 92.31,35.13 92.31,27.91 93.58,26.63 94.36,26.63 95.17,25.81 95.17,24.38 95.39,24.17 95.39,21.33 JP8.5
D46
  Top 0.203: JP15.2 JP14.2
  Route2 0.203: JP14.2 JP13.2
  Route15 0.203: JP13.2 88.81,39.67 88.81,23.02 JP9.13
D47
  Top 0.203: JP13.1 JP14.1 JP15.1
  Route15 0.203: JP13.1 92.53,38.49 92.53,22.65 93.63,21.55 94.29,21.55 95.13,20.71 95.13,19.29 JP8.4
D+  (via drill 0.41 pad 0.91)
  Top 0.203: R46.2 5.52,13.54 v3.57,13.54
  Bottom 0.203: X2.D+ v3.57,13.54
D-  (via drill 0.41 pad 0.91)
  Top 0.203: R47.2 7.52,11.34 7.52,12.96 8.16,13.6 v9.14,13.6
  Bottom 0.203: X2.D- 8.27,12.74 v9.14,13.6
E8_BUSY  (via drill 0.41 pad 0.91)
  Top 0.203: MCU.32 34.7,29.44 v33.5,28.24
  Route2 0.203: v16.81,8.09 18.75,10.03 18.75,17.59 v28.17,27
  Route15 0.203: v28.17,27 28.55,27 30.06,28.51 33.22,28.51 v33.5,28.24 | JP19.9 10.3,7.62 16.34,7.62 v16.81,8.09
  Bottom 0.203: v16.81,8.09 17.33,8.09 18.42,9.18 IC4.26
E8_CLK  (via drill 0.41 pad 0.91)
  Top 0.203: MCU.31 35.37,28.94 v34.67,28.24
  Bottom 0.203: v34.67,28.24 35.56,28.24 36.42,27.38 36.42,26.75 34.68,25 34.68,22.88 31.11,19.31 31.11,18.9 18.91,6.7 18.5,6.7 JP19.1 | v34.67,28.24
E8_RX  (via drill 0.41 pad 0.91)
  Top 0.203: v30.55,27.39 34.9,27.39 35.95,28.44 | 35.95,28.44 | 35.95,28.44 MCU.30
  Bottom 0.203: 9.59,6.75 9.59,8.25 13.65,12.32 13.65,13.87 13.58,13.94 13.58,14.58 15.79,16.8 19.95,16.8 v30.55,27.39 | JP19.11 6.84,5.66 7.93,6.75 9.59,6.75 | 9.59,6.75 9.59,5.41 10.39,4.6 11.37,4.6 12.15,5.38 12.15,5.87 13.6,7.33 17.14,7.33 18.92,9.1 IC4.25
E8_TX  (via drill 0.41 pad 0.91)
  Top 0.203: MCU.29 36.4,27.94 35.66,27.21 v35.66,27.06
  Bottom 0.203: 19.42,9.05 20.67,9.05 30.7,19.08 30.7,20.98 32.85,23.13 32.85,24.25 v35.66,27.06 | JP19.5 14.46,5.66 15.5,6.7 17.12,6.7 19.42,8.99 19.42,9.05 | 19.42,9.05 IC4.24
ENABLE_PANDA
  Top 0.203: R45.2 15.72,18.1 13.52,20.3 R35.1
  Top 0.61: U$3.3 12.86,21.16 R35.1
GND  (via drill 0.3, 0.41 pad 0.91, 0.6)
  Top 0.203: IC2.4 16.51,41.79 IC2.3
  Top 0.25: 20.68,29.71 20.95,29.44 MCU.94 | 29.42,22.64 30.02,22.04 Y1.2 | MCU.12 29.42,22.79 v29.46,22.75 29.5,22.71 | 30.42,43.34 MCU.62
  Top 0.254: 67.25,16.08 69.86,16.08 U1.18 | 71.92,10.65 71.51,11.05 U1.1
  Top 0.305: 89.22,11.33 U2.11
  Top 1.016: 59.61,26.24 R4.2 | 59.61,26.24 62.49,29.12 62.49,29.66 JP18.7 | 65.21,18.31 65.21,20.64 59.61,26.24 | 65.21,18.31 65.21,18.12 67.25,16.08 C2.1 | 65.21,18.31 59.44,18.31 R21.2 | 47.67,6.39 C7.2 | 47.67,6.39 50.77,9.49 54.55,9.49 54.7,9.33 T1.1 | 44.87,7.02 47.04,7.02 47.67,6.39 | v9.33,16.33 7.41,16.33 C30.- 7.39,16.99 6.58,17.8 | 18.98,30.86 18.98,35.23 C28.2 | 18.98,30.86 18.83,30.86 17.52,29.55 C1.2 C5.2 16.91,26.88 16.91,26.53 16.82,26.44 | 20.68,29.71 20.68,29.95 19.78,30.86 18.98,30.86 | 16.82,26.44 12.37,26.44 11.59,27.23 U$3.7 11.59,30.36 C11.2 R29.1 R36.2 | JP11.1 92.93,7.62 89.22,11.33 | C31.- 90.42,32.03 88.05,29.66 | JP13.7 88.05,29.66 | 88.05,29.66 89.41,28.3 C18.1 | JP5.2 60.99,7.87 61.74,7.87 C8.2 | 29,46.29 30.09,45.2 30.09,43.34 | 27.55,11.33 24.68,11.33 23.73,12.28 R34.2 20.24,18.04 19.47,18.81 18.13,20.15 R44.2 16.53,21.84 | JP19.14 1.75,4.62 1.75,16.17 3.65,18.08 6.31,18.08 6.58,17.8 | 6.58,17.8 C13.2 8.42,21.06 C100.- 6.28,25.35 | D100.1 6.28,25.35 | C14.2 5.49,25.35 6.28,25.35 | 76.11,17.73 C16.1 | 76.11,17.73 73.47,20.38 C12.2 71.86,20.38 69.86,18.38 69.86,16.08 | 76.11,17.73 77.59,17.73 80.22,20.36 C32.2 | MOTOR3.6 MOTOR3.4 | MOTOR1.6 MOTOR1.8 | 16.82,26.44 C19.2 18.73,24.04 16.53,21.84 | MOTOR2.6 MOTOR2.4 | MOTOR1.4 MOTOR1.2 | MOTOR0.8 57.15,40.3 59.71,40.3 | R15.2 59.71,40.3 | LED1.C 4.29,51.54 LED2.C 4.34,51.49 LED3.C LED4.C LED5.C LED6.C 13.05,51.49 | C3.1 79.15,12.32 C17.1 79.33,10.65 | MOTOR0.2 MOTOR0.4 | 29.42,22.64 29.5,22.71 | 16.51,41.79 16.51,43.28 C26.2 16.57,43.68 | 59.71,40.3 60.13,40.3 61.89,38.54 61.89,35.73 60,33.84 R9.2 | S1.1 27.55,11.33 | 27.55,11.33 27.55,11.5
  Top 1.016: JP10.5 43.18,5.33 44.87,7.02 | 16.53,21.84 16.08,21.39 C27.1 R45.1 | 79.33,10.65 71.92,10.65 | LED8.C 29,46.29 | 30.09,43.34 30.42,43.34 | 30.09,43.34 C4.2 | 44.87,7.02 44.87,11.26 37.33,18.8 C6.2 | JMP1.3 84.59,9.12 83.84,8.37 v81.84,8.37 80.27,8.37 79.33,9.31 79.33,10.65 | 29,46.29 29.85,47.13 29.85,48.44 29.26,49.02 28.32,49.02 JP3.7 25.21,49.22 22.11,49.22
  Route2 1.016: MOTOR1.8 56.95,32.7 61.38,32.7 JP18.7 | MOTOR3.6 MOTOR3.8 | MOTOR1.4 MOTOR1.6 | MOTOR2.6 MOTOR2.8 | MOTOR1.2 46.57,32.48 46.57,37.34 MOTOR0.2 | MOTOR0.6 MOTOR0.8 | T1.1 46.16,19.92 46.16,22.03 MOTOR2.2 | JP11.2 JP11.1 | JP19.10 9.85,1.6 11.91,1.6 JP19.6 14.89,1.64 17.02,1.64 JP19.2 | S1.1 29.46,10.1 v29.46,22.75 | MOTOR3.4 MOTOR3.2 30.53,46.81 JP3.7
  Route15 1.016: v15.7,9.96 25.79,9.96 S1.1 27.55,4.2 | T1.1 57.6,9.33 JP5.2 63.42,8.37 v81.84,8.37 93.05,8.37 JP11.1 | 40.64,2.36 JP10.4 | 27.55,4.2 38.8,4.2 40.64,2.36 | JP10.5 40.82,2.54 40.64,2.36 | 27.55,4.2 27.55,3.18 | 27.55,3.18 S1.2 | JP19.2 18.56,3.18 27.55,3.18 | MOTOR0.4 MOTOR0.6 | JP19.10 JP19.12 JP19.14 | MOTOR2.2 MOTOR2.4
  Bottom 0.203: IC4.EXP 17.92,11.34 IC4.2 15.91,11.34 15.64,11.07 15.64,10.6 15.99,10.25 | 15.99,10.25 16.01,10.24 IC4.M | v15.7,9.96 15.99,10.25
  Bottom 0.5: 7.58,15.6 X2.GND
  Bottom 1.016: JP18.7 64.85,30.09 C20.1 66.36,30.09 66.79,29.66 JP17.7 70.41,29.66 70.62,29.88 | 9.33,15.66 v9.33,16.33 | 70.62,29.88 70.87,29.88 71.09,29.66 JP16.7 74.95,29.66 75.1,29.81 | 70.62,29.88 C21.1 | MOTOR0.2 48.04,40.28 46.64,41.68 46.64,45.31 MOTOR3.2 | MOTOR2.2 47.64,24.98 46.37,26.26 46.37,29.74 MOTOR1.2 | 9.33,15.66 7.64,15.66 7.58,15.6 | C33.2 10.01,15.66 9.33,15.66 | 83.97,29.88 83.75,29.66 JP14.7 79.89,29.66 79.67,29.88 79.27,29.88 | C24.1 83.97,29.88 | 79.27,29.88 C23.1 | 79.27,29.88 79.05,29.66 JP15.7 75.49,29.66 75.34,29.81 75.1,29.81 | 75.1,29.81 C22.1 | 83.97,29.88 84.19,29.66 JP13.7 87.59,29.66 C25.1
  other vias: 11.62,26.14 12.82,25.74 15.52,36.34 20.62,34.84 31.32,36.54 33.92,36.54 32.92,33.94 29.92,34.24 35.72,30.84 32.82,31.24 28.82,31.14 24.32,31.24 20.62,31.24 18.02,32.64 22.22,24.64 22.72,22.94 20.72,27.44 61.12,27.84 61.12,26.04 61.02,34.94 66.52,36.04 67.02,33.54 70.82,36.04 71.02,33.94 75.12,34.14 75.22,36.74 79.82,36.44 79.62,33.54 83.92,33.54 83.92,36.04 89.92,36.34 91.02,35.14 89.92,33.44 90.02,39.24 83.92,38.54 83.92,41.14 79.72,38.64 79.72,41.14 79.72,43.64 83.92,43.54 75.32,43.64 75.32,41.04 70.92,41.24 70.92,43.64 66.82,41.34 61.32,40.24 66.92,39.04 71.32,38.94 75.12,38.84 45.12,38.74 35.72,48.04 34.72,49.04 37.82,48.74 40.12,48.84 42.12,46.94 39.42,46.94 45.62,48.94 44.52,46.84 66.72,46.04 61.82,48.74 70.32,45.94 75.22,45.94 79.62,46.04 84.02,46.04 83.92,28.34 83.92,25.64 90.02,28.24 90.02,26.24 86.02,22.44 84.42,20.94 88.72,21.64 85.82,19.24 91.72,18.74 82.72,19.14 82.02,22.04 14.02,25.74 15.22,25.74 4.62,29.04 2.72,29.04 2.72,30.74 4.62,30.74 3.82,23.34 5.52,20.44 10.32,17.34 4.12,20.44 2.72,20.44 1.32,20.44 1.72,15.54 1.72,13.64 1.72,11.74 23.83,14.63 23.13,12.63 25.33,11.23 25.33,4.93 23.23,4.93 20.73,4.93 25.23,8.13 45.73,7.73 48.13,9.33 54.83,7.73 48.53,3.03 66.33,6.53 68.73,6.53 73.43,8.63 76.63,8.63 41.83,4.33 39.23,5.43 37.83,5.43 36.43,5.43 34.93,5.43 33.73,5.43 30.33,2.03 45.13,15.93 48.23,15.93 52.93,16.03 41.33,16.13 48.03,12.23 45.23,12.33 60.83,14.83 64.83,11.43 58.43,16.53 65.43,16.23 67.13,16.43 70.13,16.93 70.73,20.33 69.33,22.53 70.93,25.23 70.93,28.43 67.23,28.43 75.23,28.53 56.63,48.83 90.42,47.94 88.22,45.64 6.52,30.74 4.62,32.64 6.52,32.64 8.32,32.64 8.32,34.44 8.32,36.24 8.32,39.34 10.12,39.34 11.92,39.34 9.02,29.44 5.52,27.84 8.62,24.34 16.42,25.74 17.62,25.74 16.42,26.94 15.22,26.94 15.22,24.54 11.62,24.94 8.32,21.84 15.02,43.64 20.72,40.84 22.42,40.84 14.02,44.54 43.52,23.64 31.23,11.43 32.03,17.13 31.33,8.83 63.53,19.53 62.42,30.74 27.62,36.04 23.04,39.21 97.42,1.74 93.02,4.34 1.62,37.34 1.62,39.14 1.62,40.94 43.12,30.84 44.02,30.84 44.92,30.84
  pour Bottom: 0.02,-0.06 99.32,-0.06 99.32,53.24 -0.08,53.24 -0.08,0.04
  pour Top: 99.22,53.34 99.22,0.14 0.02,0.14 0.02,53.34
  pour Route2: 99.62,0.04 99.62,53.64 0.02,53.64 0.02,0.04
  pour Route15: 12.62,9.84 12.62,49.84 67.12,49.84 67.12,21.44 79.62,21.44 79.62,0.24 99.12,0.24 99.12,53.24 -0.18,53.24 -0.08,9.84 12.22,9.74
HOLD  (via drill 0.41 pad 0.91)
  Top 0.203: MCU.39 32.06,32.94 v31.86,32.74
  Route2 0.203: JP19.4 14.92,4.16 14.92,8.15 18.25,11.49 | 18.25,22.65 v25.75,30.14
  Route2 0.254: 18.25,22.65 18.25,11.49
  Route15 0.203: v25.75,30.14 28.35,32.74 v31.86,32.74
INT_GYRO_3V
  Top 0.203: U1.12 76.62,15.28 79.46,18.11 83.51,18.11 83.71,17.91 83.71,15.47 83.3,15.06 | U2.5 83.3,15.06 | 83.3,15.06 86.41,11.95 86.41,8.33 TP4.TP
MISO_3V  (via drill 0.41 pad 0.91)
  Top 0.203: v76.23,13.84 76.12,13.73 U1.9 | U2.3 82.52,16.37 v81.77,15.62
  Route15 0.203: v81.77,15.62 79.99,13.84 v76.23,13.84
MISO_5V_D50  (via drill 0.41 pad 0.91)
  Top 0.203: MCU.22 34.42,23.83 35.95,22.3 TP37.TP 37.81,21.33 45.91,13.24 66.08,13.24 72.54,6.79 75.07,6.79 TP2.TP v77.12,6.54 | U2.18 89.34,16.37 93.05,12.66 JP9.15
  Route2 0.203: JP9.15 89.09,7.66 78.24,7.66 v77.12,6.54
MOSI0
  Top 0.203: MOTOR0.5 53.12,35.23 53.21,35.14 R2.2
MOSI1
  Top 0.203: MOTOR1.5 52.92,27.63 53.01,27.54 R1.2
MOSI2
  Top 0.203: MOTOR2.5 52.72,19.93 52.81,19.84 R20.2
MOSI3
  Top 0.203: MOTOR3.5 53.22,43.23 53.31,43.14 R14.2
MOSI_3V
  Top 0.203: U2.7 83.36,13.76 85.59,11.54 85.59,8.96 84.17,7.55 79.63,7.55 77.59,9.59 71.79,9.59 70.69,10.69 U1.24
MOSI_5V_D51  (via drill 0.41 pad 0.91)
  Top 0.203: MCU.20 33.42,23.92 33.68,23.66 33.92,23.66 37.36,20.22 TP38.TP 37.74,20.22 v38.6,19.37 | 97.21,8.94 97.15,8.88 93.35,8.88 90.75,11.47 90.75,13.02 90.01,13.76 U2.14 | JP8.2 97.63,11.72 97.63,9.36 97.21,8.94 | 97.21,8.94 97.98,8.17 97.98,7.13 97.22,6.36 92.62,6.36 92.01,6.97 90.25,6.97 TP6.TP
  Route15 0.203: v38.6,19.37 38.9,19.06 58.71,19.06 66.33,11.44 95.39,11.44 JP8.2
N$1
  Top 0.203: MCU.5 25.92,22.45 C10.1
N$2
  Top 0.508: T1.2 58.74,11.87 LED7.C
  Bottom 0.508: JP2.2 53.35,8.47 T1.2
N$3
  Top 0.203: R44.1 21,19.15 24.08,19.15 24.55,19.62 24.55,22.27 25.42,23.14 MCU.4
N$5
  Top 0.203: MCU.3 24.92,23.23 C10.2
N$6  (via drill 0.41 pad 0.91)
  Top 0.203: v51.25,8.32 50.66,7.72 R3.1
  Route15 0.203: T1.3 51.25,8.91 v51.25,8.32
N$7
  Top 0.203: Q1.4 27.56,15.1 27.56,17.52 27.73,17.69 27.73,23.36 27.92,23.55 MCU.9
N$49
  Top 0.203: Q1.1 27.33,17.92 27.33,23.53 27.42,23.62 MCU.8
N$54
  Top 0.203: MCU.6 26.41,20.94 R26.1
N$55
  Top 0.305: IC2.1 20.27,41.79 21.12,42.64 21.12,44.39 | 21.12,44.39 R49.2 | 21.12,44.39 21.12,44.59 R48.1
N$73
  Top 0.508: U2.10 82.89,11.8 JMP1.2
N$84
  Top 0.203: R31.1 33.65,22.12 32.01,22.12 30.92,23.2 MCU.15
N$85
  Top 0.203: R42.2 LED7.A
N$96
  Top 0.203: 15.67,23.14 C27.2
  Top 0.61: U$3.4 15.67,23.14
N$97
  Top 0.203: R38.2 LED3.A
N$109
  Top 0.203: 12.86,29.93 C11.1 | 15.77,31.24 C9.1
  Top 0.61: U$3.6 12.86,29.93 | C11.1 15.77,31.24
N$120
  Top 0.203: 15.77,33.44 C9.2
  Top 0.61: R29.2 15.77,33.44
N$121  (via drill 0.41 pad 0.91)
  Top 0.61: U$3.1 v9.32,23.13
  Bottom 0.61: C15.2 10.32,24.94 v9.32,23.13
N$125
  Top 0.203: U$3.5 14.31,28.34 16.8,30.83 16.8,33.84 15,35.64 R36.1
  Top 0.61: R37.2 R36.1
N$126
  Top 0.203: R27.2 2.25,48.46 LED1.A
N$127
  Top 0.203: R28.2 4.3,48.44 LED2.A
N$138  (via drill 0.41 pad 0.91)
  Top 1.016: D100.3 v9.04,28.14 10.12,28.14 U$3.8 L1.1
  Bottom 1.016: v9.04,28.14 10.08,28.14 C15.1
N$149
  Top 0.203: R39.2 LED4.A
N$150
  Top 0.203: R40.2 LED5.A
N$161
  Top 0.203: R41.2 LED6.A
N$206
  Top 0.203: R43.2 28.68,47.83 LED8.A
P1_0
  Top 0.203: R38.1 10.3,42.77 11.67,42.77 15.84,38.6 19.67,38.6 20.83,37.44 MCU.78
P1_1
  Top 0.203: R39.1 16.04,39.13 19.78,39.13 20.96,37.94 MCU.77
P1_2
  Top 0.203: R40.1 10.62,45.52 16.61,39.53 21.33,39.53 MCU.76
P1_3
  Top 0.203: MCU.75 16.83,39.94 12.72,44.05 R41.1
P1_4
  Top 0.203: R43.1 26.09,46.05 22.9,42.86 22.9,42.06 23.7,41.25 24.15,41.25 24.42,40.98 MCU.74
P1_5
  Top 0.203: TP39.TP 24.92,41.34 MCU.73
P1_6
  Top 0.203: TP40.TP MCU.72
P1_7
  Top 0.203: TP41.TP 25.92,41.34 MCU.71
P7_4  (via drill 0.41 pad 0.91)
  Top 0.203: TP43.TP 36.52,16.75 v36.16,17.11 | MCU.24 35.42,23.94 v36.07,23.29
  Bottom 0.203: v36.16,17.11 36.16,23.2 v36.07,23.29
P7_5  (via drill 0.41 pad 0.91)
  Top 0.203: TP44.TP 34.8,15.96 v34.8,17.11 | v36.68,25.67 36.11,26.24 35.13,26.24 34.92,26.03 MCU.23
  Bottom 0.203: v34.8,17.11 35.2,17.52 35.2,24.19 v36.68,25.67
REGOUT
  Top 0.203: C3.2 77,14.64 75.9,14.64 75.53,14.27 U1.10
RESET  (via drill 0.41 pad 0.91)
  Top 0.203: MCU.10 28.42,23.47 28.14,23.19 28.14,17.23 R30.1 29.98,15.39 29.98,9.1 27.97,7.09 24.13,7.09 | IC2.2 17.45,41.26 18,40.7 v18.65,40.7 | S1.4 24.13,2.79 24.13,7.09 | S1.3 24.13,7.09
  Route2 0.203: JP19.13 6.54,8.94 6.54,28.6 v18.65,40.7
  Route15 0.203: S1.3 22.42,8.8 12.35,8.8 11.99,8.44 6.04,8.44 JP19.13
RESET_MOTOR_5V_D48  (via drill 0.41 pad 0.91)
  Top 0.203: MCU.18 32.42,23.91 33.45,22.89 v33.61,22.89 | JP9.14 94.31,15.2 95.54,13.97 97.1,13.97 98.39,12.68 98.39,6.96 97.36,5.93 92.48,5.93 91.84,6.57 91.06,6.57 89.85,5.35 89.85,5.27 89.29,4.71 85.94,4.71 85,5.64 | U2.12 88.31,12.46 87.94,12.09 87.94,8.57 85,5.64 | 85,5.64 84.08,4.72 79.55,4.72 TP8.TP
  Route15 0.203: JP9.14 90.74,12.11 67.73,12.11 60.37,19.47 39.79,19.47 37.72,21.54 34.95,21.54 v33.61,22.89
RX2  (via drill 0.41 pad 0.91)
  Top 0.203: v40.44,34.37 40.23,34.57 39.17,34.57 38.73,34.13 38.73,33.74 38.43,33.44 MCU.40 | TP36.TP 76,47.96 JP1.5
  Route2 0.203: v40.44,34.37 42.08,34.37 48.9,41.2 60.94,41.2 63.38,43.63 68.98,43.63 JP1.5
RX3  (via drill 0.41 pad 0.91)
  Top 0.203: MCU.45 38.47,35.94 v39.07,35.34 | JP1.7 TP33.TP
  Route2 0.203: v39.07,35.34 45.74,42.01 59.19,42.01 66.63,49.45 69.72,49.45 JP1.7
SCLK_3V
  Top 0.203: U2.6 83.29,14.41 86,11.71 86,8.79 84.34,7.14 79.08,7.14 78.5,7.71 73.06,7.71 69.87,10.9 69.87,12.93 70.17,13.23 U1.23
SCLK_5V_D52  (via drill 0.41 pad 0.91)
  Top 0.203: MCU.21 v33.92,26.6 | JP9.16 93.83,10.55 89.97,14.41 U2.15 | TP5.TP v87.22,6.54
  Route2 0.203: JP9.16 90.25,6.54 v87.22,6.54
  Route15 0.203: JP9.16 63.07,10.12 55.88,17.31 39.65,17.31 36.49,20.46 34.95,20.46 32.71,22.7 32.71,23.52 31.4,24.83 31.4,26.88 31.81,27.3 32.4,27.3 33.1,26.6 v33.92,26.6
TX2  (via drill 0.41 pad 0.91)
  Top 0.203: MCU.38 38.48,32.44 39.49,33.45 v39.49,33.81 | TP35.TP 73.46,48 JP1.6
  Route2 0.203: v39.49,33.81 39.49,34.45 46.64,41.6 59.65,41.6 65.31,47.26 69.81,47.26 | 69.81,47.26 | 69.81,47.26 JP1.6
TX3  (via drill 0.41 pad 0.91)
  Top 0.203: v39.06,36.44 MCU.46 | TP34.TP 68.38,48 JP1.8
  Route2 0.203: JP1.8 66.41,50.91 57.92,42.41 45.03,42.41 v39.06,36.44
USBH4_DM  (via drill 0.41 pad 0.91)
  Top 0.203: R47.1 v13.24,10.44
  Bottom 0.203: IC4.4 15.32,12.34 14.54,11.55 14.03,11.55 13.24,10.76 v13.24,10.44
USBH4_DP  (via drill 0.41 pad 0.91)
  Top 0.203: R46.1 9.45,11.41 13.78,11.41 v14.4,10.79
  Bottom 0.203: v14.4,10.79 15.45,11.84 IC4.3
VBUS  (via drill 0.41 pad 0.91)
  Top 0.508: v10.76,12.3 14.15,12.3 v16.52,14.67
  Bottom 0.203: 16.86,14.33 16.91,14.33 IC4.8 | IC4.7 16.86,14.28 16.86,14.29
  Bottom 0.508: v16.52,14.67 16.86,14.33 16.86,14.29 | X2.VBUS 10.39,11.94 v10.76,12.3
VIN  (via drill 0.41 pad 0.91)
  Top 0.508: 12.8,16.7 C30.+ | 12.8,18.79 R35.2 | 11.59,20.01 C13.1 | JP5.1 58.45,7.62 60.76,9.93 C8.1 62.02,10.35 R42.1 | JP10.6 45.77,2.34 C7.1
  Top 0.61: v16.56,16.02 15.88,16.7 12.8,16.7 12.8,18.79 11.59,20.01
  Top 1.016: U$3.2 11.59,20.01
  Route2 0.508: JP2.1 JP5.1
  Route15 0.508: v16.56,16.02 28.35,16.02 37.88,6.48 41.52,6.48 JP10.6 47.7,4.27 54.21,4.27 JP2.1
WR  (via drill 0.41 pad 0.91)
  Top 0.203: MCU.44 35.73,35.44 v35.12,34.84
  Route15 0.203: v35.12,34.84 29.44,34.84 10.49,15.89 10.49,13.93 3.48,6.93 2.99,6.93 2.21,6.15 2.21,5.19 2.8,4.6 9.82,4.6 JP19.7
XIN
  Top 0.203: MCU.13 29.92,23.48 31.02,22.38 Y1.3
XOUT
  Top 0.203: Y1.1 28.55,21.38 28.55,23.02 28.92,23.4 MCU.11

## Text on the board
tPlace: 22 | 14 | 15 | 16 | 17 | 18 | 19 | 20 | 21 | 24 | 26 | 28 | 30 | 32 | 34 | 36 | 38 | 40 | 42 | 44 | 46 | 48 | 50 | 52 | ANALOG IN | 0 | 1 | 2 | 3 | 4 | 5 | 6 | 7 | 8 | 9 | 10 | 11 | 12 | 13 | 14 | 15 | RES | RESET
tNames: C:/Users/TS/Dropbox/kuukulgur.bmp
bNames: C:/Users/TS/Dropbox/kuukulgur.bmp